# EAGLE board in3watch (EAGLE 6.4)
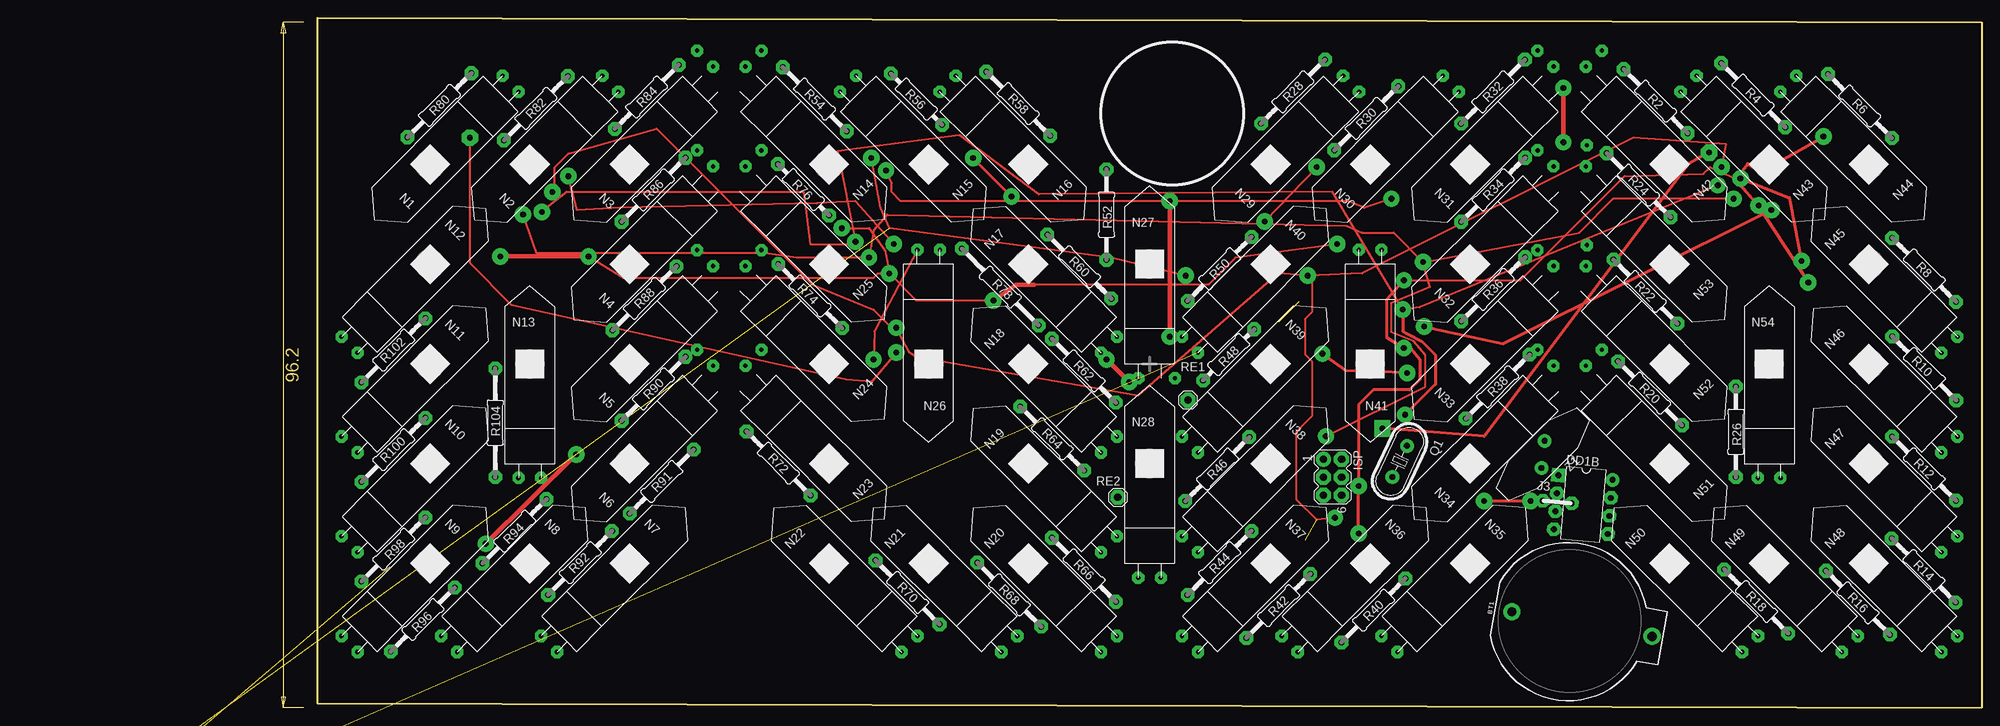
[diagram p5: board, top side]
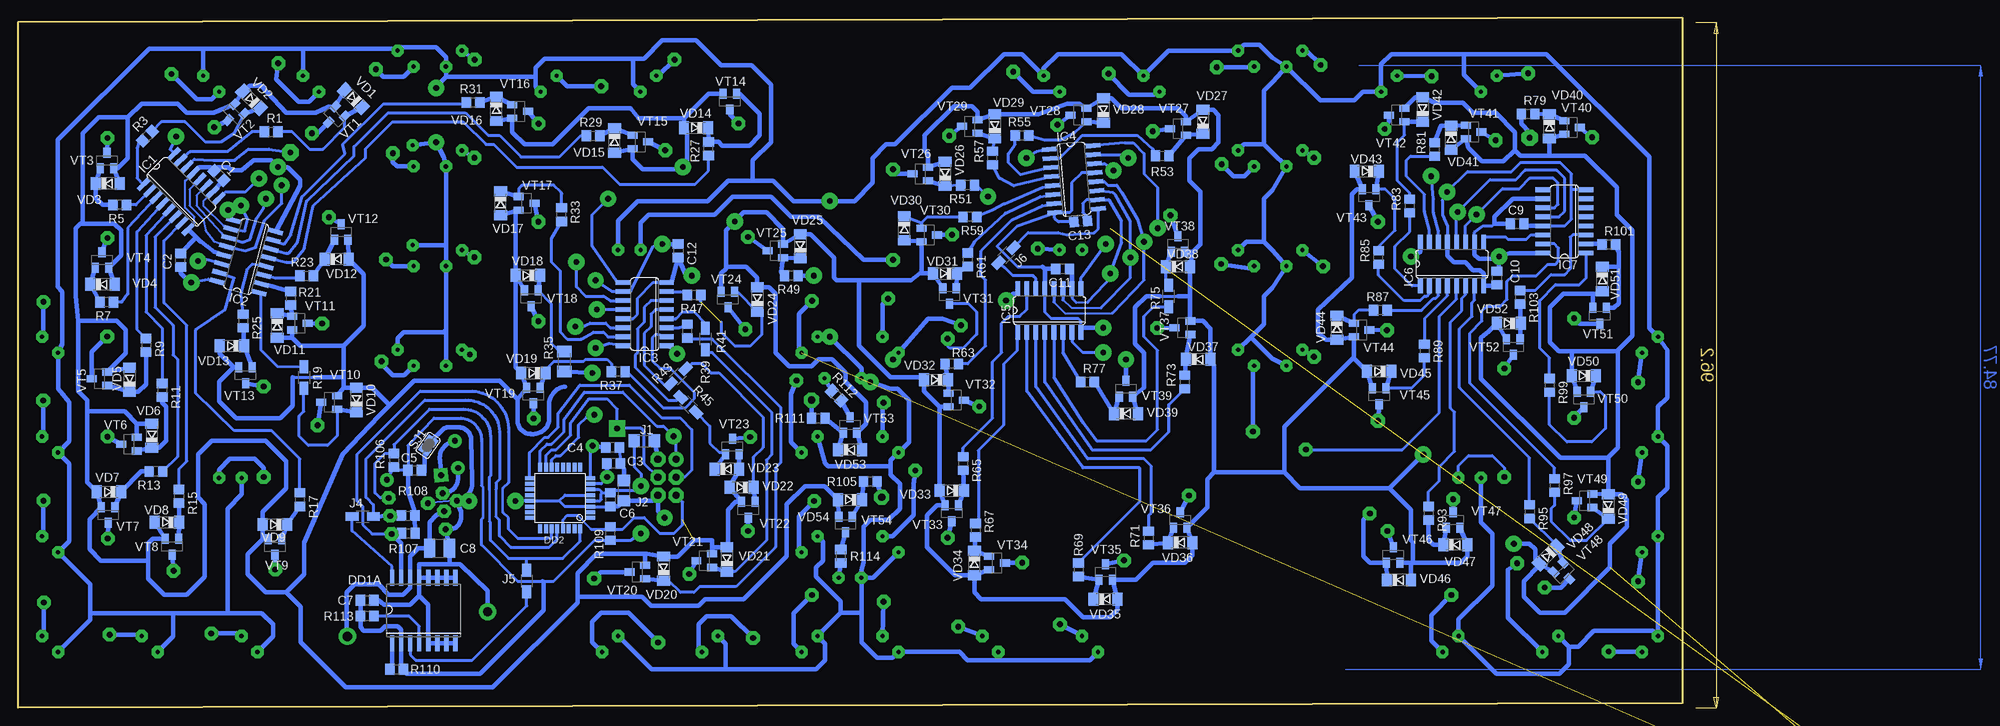
[diagram p6: board, bottom side, seen from below]

Size 233.68 x 96.84 mm. Coordinates in mm from the lower left corner, seen from the top.
Outline: 0,96.84 233.68,96.2 233.68,0 0,0.63 0,96.84
Copper layers (1*16): Top 0.035mm / dielectric 1.5mm / Bottom 0.035mm
Design rules "DesignRules": minimum track width 8mil, minimum drill 24mil, track to track 0.2mm, track to pad 0.2mm, pad to pad 8mil, via to via 8mil, smd to smd 8mil, copper to edge 10mil, drill to drill 8mil, minimum pad ring 0.55mm, minimum via ring 8mil, stop-mask expansion 4mil, vias tented up to drill 0mil, thermal gap 10mil

## Footprints (pad centres in the part's own frame; a part is rotated, then mirrored left to right if it is on the bottom)
BATTCOM_20MM_PTH = drill 1.3: 1 11.85,0; 2 -8.15,0
C0805 = smd 1.3 x 1.5: 1 -0.95,0; 2 0.95,0
C3225 = smd 1.6 x 2.7: 1 -1.4,0; 2 1.4,0
SOIC-16W = smd 0.6 x 2.2: 1 -4.445,-4.6; 2 -3.175,-4.6; 3 -1.905,-4.6; 4 -0.635,-4.6; 5 0.635,-4.6; 6 1.905,-4.6; 7 3.175,-4.6; 8 4.445,-4.6; 9 4.445,4.6; 10 3.175,4.6; 11 1.905,4.6; 12 0.635,4.6; 13 -0.635,4.6; 14 -1.905,4.6; 15 -3.175,4.6; 16 -4.445,4.6
DIL08 = drill 0.813 square: 1 -3.81,-3.81 | drill 0.813 octagon: 2 -1.27,-3.81; 3 1.27,-3.81; 4 3.81,-3.81; 5 3.81,3.81; 6 1.27,3.81; 7 -1.27,3.81 | drill 0.813: 8 -3.81,3.81
TQFP32-08 = smd 1.27 x 0.559: 1 -4.293,2.8; 2 -4.293,2; 3 -4.293,1.2; 4 -4.293,0.4; 5 -4.293,-0.4; 6 -4.293,-1.2; 7 -4.293,-2; 8 -4.293,-2.8; 17 4.293,-2.8; 18 4.293,-2; 19 4.293,-1.2; 20 4.293,-0.4; 21 4.293,0.4; 22 4.293,1.2; 23 4.293,2; 24 4.293,2.8 | smd 0.559 x 1.27: 9 -2.8,-4.293; 10 -2,-4.293; 11 -1.2,-4.293; 12 -0.4,-4.293; 13 0.4,-4.293; 14 1.2,-4.293; 15 2,-4.293; 16 2.8,-4.293; 25 2.8,4.293; 26 2,4.293; 27 1.2,4.293; 28 0.4,4.293; 29 -0.4,4.293; 30 -1.2,4.293; 31 -2,4.293; 32 -2.8,4.293
SO16 = smd 0.66 x 2.032: 1 -4.445,-3.073; 2 -3.175,-3.073; 3 -1.905,-3.073; 4 -0.635,-3.073; 5 0.635,-3.073; 6 1.905,-3.073; 7 3.175,-3.073; 8 4.445,-3.073; 9 4.445,3.073; 10 3.175,3.073; 11 1.905,3.073; 12 0.635,3.073; 13 -0.635,3.073; 14 -1.905,3.073; 15 -3.175,3.073; 16 -4.445,3.073
MA03-2 = drill 1.016: 1 -2.54,-1.27 | drill 1.016 octagon: 2 -2.54,1.27; 3 0,-1.27; 4 0,1.27; 5 2.54,-1.27; 6 2.54,1.27
R1206 = smd 1.6 x 1.803: 1 -1.422,0; 2 1.422,0
05 = drill 0.813 pad 1.6 octagon: 1 -0.04,0; 2 4.04,0
R1206W = smd 1.8 x 1.2: 1 -1.499,0; 2 1.499,0
IN-3 = drill 0.6 octagon: A -1.587,-16; K 1.587,-16
IN-3-2 = drill 0.6 octagon: A 1.413,-18; K 4.588,-18
IN-3-1 = drill 0.6 octagon: A -4.588,-18; K -1.413,-18
IN-3-3 = drill 0.6 octagon: A -1.587,-16; K 3.587,-16
IN-3-11 = drill 0.6 octagon: A -3.587,-20; K -1.413,-18
HC49U70 = drill 0.813: 1 -2.413,0; 2 2.413,0
R0805 = smd 1.3 x 1.5: 1 -0.95,0; 2 0.95,0
0207/12 = drill 0.813 octagon: 1 -6.35,0; 2 6.35,0
M1206 = smd 1.6 x 2: 1 -1.4,0; 2 1.4,0
0207/10 = drill 0.813 octagon: 1 -5.08,0; 2 5.08,0
0207/15 = drill 0.813 octagon: 1 -7.62,0; 2 7.62,0
M0805 = smd 1.3 x 1.6: 1 -0.95,0; 2 0.95,0
R0603 = smd 1 x 1.1: 1 -0.85,0; 2 0.85,0
1X01 = drill 1.016 octagon: 1 0,0
SJ = smd 1.168 x 1.6: 1 -0.762,0; 2 0.762,0
SOD80C = smd 1.4 x 1.8: A 1.7,0; C -1.7,0
SOT23-BEC = smd 1 x 1.4: B -0.95,-1.1; C 0,1.1; E 0.95,-1.1
FC-12M = drill 0.8: P$1 1.5,1.2; P$2 -1.5,-1.2

## Placement (x,y rotation side)
BT1  2032 3v  [BATTCOM_20MM_PTH]  175.74,12.06 350 top
C1  [C0805]  205.42,74.71 135 bottom
C2  [C0805]  210.82,62.8 90 bottom
C3  [C0805]  150.02,34.29 180 bottom
C4  [C0805]  150.18,36.51 180 bottom
C5  [C0805]  177.96,33.34 0 bottom
C6  [C0805]  150.5,29.21 270 bottom
C7  [C0805]  184.63,15.08 0 bottom
C8  [C3225]  174.47,22.38 0 bottom
C9  [C0805]  23.18,67.94 0 bottom
C10  [C0805]  26.03,60.32 270 bottom
C11  [C0805]  87,61.59 180 bottom
C12  [C0805]  140.97,64.13 270 bottom
C13  [C0805]  84.46,68.26 185 bottom
DD1A  [SOIC-16W]  176.69,13.65 0 bottom
DD1B  DS1307  [DIL08]  177.72,28.52 265 top
DD2  ATMEGA328P  [TQFP32-08]  157.53,29.44 180 bottom
IC1  74HC595D  [SO16]  210.73,72.46 315 bottom
IC2  74HC595D  [SO16]  201.6,63.34 75 bottom
IC3  74HC595D  [SO16]  145.67,55.24 90 bottom
IC4  74HC595D  [SO16]  85.43,74.2 275 bottom
IC5  74HC595D  [SO16]  88.85,55.77 0 bottom
IC6  74HC595D  [SO16]  32.33,62.29 0 bottom
IC7  74HC595D  [SO16]  16.54,68.27 90 bottom
ISP  [MA03-2]  142.55,32.35 270 top
J1  [R1206]  145.73,37.46 180 bottom
J2  [R1206]  148.59,30.48 90 bottom
J3  J5MM  [05]  172.09,29.05 355 top
J4  [R1206W]  185.26,26.83 0 bottom
J5  [R1206W]  162.24,17.78 270 bottom
J6  [R1206W]  94.93,63.5 225 bottom
N1  IN-3  [IN-3]  15.84,76.26 135 top
N2  IN-3  [IN-3]  29.84,76.26 135 top
N3  IN-32  [IN-3-2]  43.84,76.26 135 top
N4  IN-32  [IN-3-2]  43.84,62.26 135 top
N5  IN-32  [IN-3-2]  43.84,48.26 135 top
N6  IN-32  [IN-3-2]  43.84,34.26 135 top
N7  IN-3  [IN-3]  43.84,20.26 315 top
N8  IN-3  [IN-3]  29.84,20.26 315 top
N9  IN-3  [IN-3]  15.84,20.26 315 top
N10  IN-3  [IN-3]  15.84,34.26 315 top
N11  IN-3  [IN-3]  15.84,48.26 315 top
N12  IN-3  [IN-3]  15.84,62.26 315 top
N13  IN-3  [IN-3]  29.84,48.26 0 top
N14  IN-31  [IN-3-1]  71.84,76.26 225 top
N15  IN-3  [IN-3]  85.84,76.26 225 top
N16  IN-3  [IN-3]  99.84,76.26 225 top
N17  IN-3  [IN-3]  99.84,62.26 45 top
N18  IN-3  [IN-3]  99.84,48.26 45 top
N19  IN-3  [IN-3]  99.84,34.26 45 top
N20  IN-3  [IN-3]  99.84,20.26 45 top
N21  IN-3  [IN-3]  85.84,20.26 45 top
N22  IN-3  [IN-3]  71.84,20.26 45 top
N23  IN-31  [IN-3-1]  71.84,34.26 225 top
N24  IN-31  [IN-3-1]  71.84,48.26 225 top
N25  IN-31  [IN-3-1]  71.84,62.26 225 top
N26  IN-3  [IN-3]  85.84,48.26 180 top
N27  IN-33  [IN-3-3]  116.84,62.26 0 top
N28  IN-3  [IN-3]  116.84,34.26 0 top
N29  IN-3  [IN-3]  133.84,76.26 135 top
N30  IN-3  [IN-3]  147.84,76.26 135 top
N31  IN-32  [IN-3-2]  161.84,76.26 135 top
N32  IN-32  [IN-3-2]  161.84,62.26 135 top
N33  IN-32  [IN-3-2]  161.84,48.26 135 top
N34  IN-32  [IN-3-2]  161.84,34.26 135 top
N35  IN-3  [IN-3]  161.84,20.26 315 top
N36  IN-3  [IN-3]  147.84,20.26 315 top
N37  IN-3  [IN-3]  133.84,20.26 315 top
N38  IN-3  [IN-3]  133.84,34.26 315 top
N39  IN-3  [IN-3]  133.84,48.26 315 top
N40  IN-3  [IN-3]  133.84,62.26 315 top
N41  IN-3  [IN-3]  147.84,48.26 180 top
N42  IN-31  [IN-3-1]  189.84,76.26 225 top
N43  IN-3  [IN-3]  203.84,76.26 225 top
N44  IN-3  [IN-3]  217.84,76.26 225 top
N45  IN-3  [IN-3]  217.84,62.26 45 top
N46  IN-3  [IN-3]  217.84,48.26 45 top
N47  IN-3  [IN-3]  217.84,34.26 45 top
N48  IN-3  [IN-3]  217.84,20.26 45 top
N49  IN-3  [IN-3]  203.84,20.26 45 top
N50  IN-3  [IN-3]  189.84,20.26 45 top
N51  IN-31  [IN-3-1]  189.84,34.26 225 top
N52  IN-311  [IN-3-11]  189.84,48.26 225 top
N53  IN-311  [IN-3-11]  189.84,62.26 225 top
N54  IN-3  [IN-3]  203.84,48.26 0 top
Q1  [HC49U70]  151.97,34.57 245 top
R1  [R0805]  198.12,80.84 0 bottom
R2  [0207/12]  187.9,85.12 135 top
R3  [R0805]  215.5,80.26 45 bottom
R4  [0207/12]  201.6,85.97 135 top
R5  [R0805]  219.36,70.57 180 bottom
R6  [0207/12]  216.59,84.45 135 top
R7  [R0805]  221.19,56.91 180 bottom
R8  [0207/12]  225.59,61.45 315 top
R9  [R0805]  215.68,50.86 270 bottom
R10  [0207/12]  225.62,47.62 315 top
R11  [R0805]  213.41,44.58 270 bottom
R12  [0207/12]  225.59,33.56 315 top
R13  [R0805]  214.28,33.16 180 bottom
R14  [0207/12]  225.53,19.27 315 top
R15  [R0805]  211.06,29.69 270 bottom
R16  [0207/12]  216.3,14.74 315 top
R17  [R0805]  194.09,29.21 270 bottom
R18  [0207/12]  202.03,14.92 315 top
R19  [R1206W]  193.52,46.35 270 bottom
R20  [0207/12]  187.1,44.13 135 top
R21  [R0805]  195.36,57.47 270 bottom
R22  [0207/12]  186.47,58.42 135 top
R23  [R0805]  193.13,60.64 0 bottom
R24  [0207/12]  185.51,73.34 135 top
R25  [R0805]  202.03,54.29 270 bottom
R26  [0207/12]  199.17,38.73 270 top
R27  [R0805]  136.71,78.47 90 bottom
R28  [0207/12]  137,86.48 45 top
R29  [R0805]  152.92,80.28 0 bottom
R30  [0207/12]  147.28,82.74 45 top
R31  [R0805]  169.75,84.96 0 bottom
R32  [0207/12]  165.06,86.47 45 top
R33  [R0805]  157.32,69.22 90 bottom
R34  [0207/12]  165.1,72.71 45 top
R35  [M1206]  156.96,48.58 90 bottom
R36  [0207/12]  165.1,58.74 45 top
R37  [R0805]  149.38,47.15 180 bottom
R38  [0207/12]  165.74,45.09 45 top
R39  [R0805]  139.7,52.86 270 bottom
R40  [0207/12]  148.27,13.65 225 top
R41  [R1206W]  137.16,51.75 270 bottom
R42  [0207/12]  134.94,14.29 225 top
R43  [R1206W]  140.97,46.51 45 bottom
R44  [0207/12]  126.68,20.32 225 top
R45  [R1206W]  139.54,42.55 315 bottom
R46  [0207/12]  126.37,33.5 225 top
R47  [R0805]  138.75,57.94 0 bottom
R48  [0207/10]  127.95,49.53 225 top
R49  [R0805]  125.09,60.64 180 bottom
R50  [0207/12]  126.68,61.59 225 top
R51  [R0805]  100.33,73.34 180 bottom
R52  [0207/12]  110.81,69.22 270 top
R53  [R0805]  73.03,77.47 0 bottom
R54  [0207/12]  69.85,85.41 135 top
R55  [R0805]  92.71,80.33 0 bottom
R56  [0207/10]  84.14,85.41 135 top
R57  [R0805]  96.84,77.15 90 bottom
R58  [0207/12]  98.43,84.77 135 top
R59  [R0805]  100.01,68.9 180 bottom
R60  [0207/12]  107,61.91 315 top
R61  [R0805]  100.33,62.86 270 bottom
R62  [0207/12]  107.63,47.31 315 top
R63  [R0805]  102.55,48.26 180 bottom
R64  [0207/12]  103.19,37.78 315 top
R65  [R0805]  100.97,34.29 270 bottom
R66  [0207/12]  107.63,19.37 315 top
R67  [R0805]  99.22,24.92 270 bottom
R68  [0207/12]  97.16,15.88 315 top
R69  [R0805]  84.77,19.37 270 bottom
R70  [0207/12]  82.87,16.19 315 top
R71  [R0805]  74.93,23.81 270 bottom
R72  [0207/12]  64.77,34.29 135 top
R73  [R0805]  69.85,45.72 90 bottom
R74  [0207/12]  69.22,57.78 135 top
R75  [R1206W]  72.07,57.78 90 bottom
R76  [0207/10]  68.26,72.71 135 top
R77  [R0805]  83.5,45.72 0 bottom
R78  [0207/15]  95.89,59.05 315 top
R79  [R0805]  21.65,83.34 0 bottom
R80  [0207/12]  17.16,84.57 45 top
R81  [R0805]  34.77,78.36 90 bottom
R82  [0207/12]  30.7,84.14 45 top
R83  [R0805]  38.26,70.42 90 bottom
R84  [0207/12]  46.26,85.72 45 top
R85  [R0805]  42.64,63.18 90 bottom
R86  [0207/12]  47.21,72.71 45 top
R87  [R0805]  42.39,55.78 180 bottom
R88  [0207/12]  45.94,57.47 45 top
R89  [R0805]  36.2,50.07 270 bottom
R90  [0207/12]  47.21,44.77 45 top
R91  [0207/12]  48.36,31.75 225 top
R92  [0207/12]  36.89,20.32 225 top
R93  [R0805]  35.62,27.3 270 bottom
R94  [0207/12]  27.69,24.76 225 top
R95  [R0805]  21.43,27.53 270 bottom
R96  [0207/12]  14.83,12.38 225 top
R97  [R0805]  17.94,31.18 270 bottom
R98  [0207/12]  10.7,22.22 225 top
R99  [R0805]  18.64,45.24 270 bottom
R100  [0207/12]  10.7,36.2 225 top
R101  [R0805]  10.32,65.02 0 bottom
R102  [0207/12]  10.7,50.16 225 top
R103  [R0805]  22.77,57.63 270 bottom
R104  [0207/15]  24.99,40 270 top
R105  [R0805]  113.98,31.75 180 bottom
R106  10k  [R0805]  180.86,34.74 270 bottom
R107  10k  [R0805]  178.84,24.5 0 bottom
R108  10k  [R0805]  178.89,26.96 0 bottom
R109  10k  [R0805]  150.5,24.45 270 bottom
R110  10k  [R0805]  180.5,5.4 0 bottom
R111  [R0805]  121.28,40.64 0 bottom
R112  [M0805]  118.75,43.81 135 bottom
R113  10k  [R0805]  184.63,12.86 180 bottom
R114  [M0805]  118.11,21.27 270 bottom
R115  [R0603]  -44.77,-23.81 270 top  (outside the outline)
R116  [R0603]  -40,-22.54 90 top  (outside the outline)
RE1  [1X01]  122.24,43.18 270 top
RE2  [1X01]  112.4,29.53 90 top
SJ1  [SJ]  176.05,36.83 55 bottom
VD1  [SOD80C]  186.57,85.5 135 bottom
VD2  [SOD80C]  200.87,85.33 135 bottom
VD3  [SOD80C]  221.05,73.58 0 bottom
VD4  [SOD80C]  221.79,59.42 0 bottom
VD5  [SOD80C]  218,46.02 90 bottom
VD6  [SOD80C]  214.87,38.18 90 bottom
VD7  [SOD80C]  220.88,30.3 180 bottom
VD8  [SOD80C]  212.74,26.05 180 bottom
VD9  [SOD80C]  197.58,25.72 180 bottom
VD10  [SOD80C]  186.15,43.18 90 bottom
VD11  [SOD80C]  197.26,53.66 270 bottom
VD12  [SOD80C]  188.91,62.96 0 bottom
VD13  [SOD80C]  203.61,50.8 180 bottom
VD14  [SOD80C]  138.47,81.42 180 bottom
VD15  [SOD80C]  149.91,79.61 270 bottom
VD16  [SOD80C]  166.5,84.05 270 bottom
VD17  [SOD80C]  165.89,70.8 270 bottom
VD18  [SOD80C]  162.08,60.69 180 bottom
VD19  [SOD80C]  161.29,46.99 180 bottom
VD20  [SOD80C]  143.03,19.53 90 bottom
VD21  [SOD80C]  134.14,20.8 90 bottom
VD22  [SOD80C]  132.08,30.96 180 bottom
VD23  [SOD80C]  134.14,33.5 0 bottom
VD24  [SOD80C]  129.86,57.31 90 bottom
VD25  [SOD80C]  123.83,64.77 90 bottom
VD26  [SOD80C]  103.5,74.93 90 bottom
VD27  [SOD80C]  67.31,82.23 90 bottom
VD28  [SOD80C]  81.28,83.82 90 bottom
VD29  [SOD80C]  96.52,81.6 90 bottom
VD30  [SOD80C]  109.22,67.31 270 bottom
VD31  [SOD80C]  103.5,60.96 180 bottom
VD32  [SOD80C]  104.78,46.04 180 bottom
VD33  [SOD80C]  102.55,30.48 180 bottom
VD34  [SOD80C]  99.38,20.32 270 bottom
VD35  [SOD80C]  80.96,15.24 0 bottom
VD36  [SOD80C]  70.49,23.18 0 bottom
VD37  [SOD80C]  67.94,48.89 0 bottom
VD38  [SOD80C]  70.8,61.91 0 bottom
VD39  [SOD80C]  78.11,41.27 0 bottom
VD40  [SOD80C]  18.64,81.6 270 bottom
VD41  [SOD80C]  32.45,80.01 270 bottom
VD42  [SOD80C]  36.45,83.98 90 bottom
VD43  [SOD80C]  44.29,75.31 180 bottom
VD44  [SOD80C]  48.48,53.34 270 bottom
VD45  [SOD80C]  42.55,47.21 180 bottom
VD46  [SOD80C]  39.78,17.94 0 bottom
VD47  [SOD80C]  31.84,22.86 0 bottom
VD48  [SOD80C]  18.83,21.43 225 bottom
VD49  [SOD80C]  10.38,28.26 90 bottom
VD50  [SOD80C]  13.81,46.61 180 bottom
VD51  [SOD80C]  11.21,60.17 270 bottom
VD52  [SOD80C]  24.35,53.97 180 bottom
VD53  [SOD80C]  116.84,36.2 0 bottom
VD54  [SOD80C]  116.84,29.21 180 bottom
VD55  [SOD80C]  -42.23,-26.35 0 top  (outside the outline)
VT1  [SOT23-BEC]  189.25,82.94 135 bottom
VT2  [SOT23-BEC]  203.37,83.27 135 bottom
VT3  [SOT23-BEC]  221.16,76.83 0 bottom
VT4  [SOT23-BEC]  221.87,62.86 0 bottom
VT5  [SOT23-BEC]  222.2,46.18 90 bottom
VT6  [SOT23-BEC]  218.09,36.99 90 bottom
VT7  [SOT23-BEC]  221,27.05 180 bottom
VT8  [SOT23-BEC]  212.03,22.6 180 bottom
VT9  [SOT23-BEC]  197.58,22.54 180 bottom
VT10  [SOT23-BEC]  189.96,42.86 90 bottom
VT11  [SOT23-BEC]  194.09,53.97 270 bottom
VT12  [SOT23-BEC]  188.28,66.77 0 bottom
VT13  [SOT23-BEC]  201.71,46.67 180 bottom
VT14  [SOT23-BEC]  133.71,85.07 180 bottom
VT15  [SOT23-BEC]  146.26,79.42 270 bottom
VT16  [SOT23-BEC]  163.17,83.7 270 bottom
VT17  [SOT23-BEC]  162.24,70.8 270 bottom
VT18  [SOT23-BEC]  161.61,57.47 180 bottom
VT19  [SOT23-BEC]  161.29,43.81 180 bottom
VT20  [SOT23-BEC]  146.69,19.05 90 bottom
VT21  [SOT23-BEC]  137.32,20.64 90 bottom
VT22  [SOT23-BEC]  131.13,27.78 180 bottom
VT23  [SOT23-BEC]  133.35,36.67 0 bottom
VT24  [SOT23-BEC]  133.99,57.31 180 bottom
VT25  [SOT23-BEC]  127.32,64.13 90 bottom
VT26  [SOT23-BEC]  107,74.93 90 bottom
VT27  [SOT23-BEC]  70.8,81.28 90 bottom
VT28  [SOT23-BEC]  84.77,83.19 90 bottom
VT29  [SOT23-BEC]  100.01,81.6 90 bottom
VT30  [SOT23-BEC]  105.73,66.36 270 bottom
VT31  [SOT23-BEC]  102.87,57.78 180 bottom
VT32  [SOT23-BEC]  101.92,43.18 270 bottom
VT33  [SOT23-BEC]  102.55,27.3 180 bottom
VT34  [SOT23-BEC]  96.2,20.32 270 bottom
VT35  [SOT23-BEC]  80.96,19.05 0 bottom
VT36  [SOT23-BEC]  70.49,26.35 0 bottom
VT37  [SOT23-BEC]  70.17,53.34 90 bottom
VT38  [SOT23-BEC]  70.8,65.09 0 bottom
VT39  [SOT23-BEC]  78.11,44.77 0 bottom
VT40  [SOT23-BEC]  15.46,81.44 270 bottom
VT41  [SOT23-BEC]  29.27,80.8 270 bottom
VT42  [SOT23-BEC]  40.1,83.19 90 bottom
VT43  [SOT23-BEC]  43.97,71.66 180 bottom
VT44  [SOT23-BEC]  44.99,53.02 270 bottom
VT45  [SOT23-BEC]  42.55,43.72 180 bottom
VT46  [SOT23-BEC]  40.58,21.43 0 bottom
VT47  [SOT23-BEC]  32.16,26.35 0 bottom
VT48  [SOT23-BEC]  16.61,18.89 225 bottom
VT49  [SOT23-BEC]  13.72,29.05 90 bottom
VT50  [SOT23-BEC]  13.81,43.27 180 bottom
VT51  [SOT23-BEC]  11.59,55.02 180 bottom
VT52  [SOT23-BEC]  23.72,50.64 180 bottom
VT53  [SOT23-BEC]  116.84,39.69 0 bottom
VT54  [SOT23-BEC]  117.48,25.72 180 bottom
VT55  [SOT23-BEC]  -42.23,-23.18 0 top  (outside the outline)
Z1  32768  [FC-12M]  172.09,35.56 225 top

## Tracks (layer width: path | path; a pad name or v marks a point on that pad's centre or on a via)
+5V  (via drill 0.8 pad 2.3)
  Top 0.254: v38.1,63.34 43.02,60.32 78.11,60.32 78.74,60.96 v80.33,60.96 | v152.56,60.01 168.91,60.01 183.51,74.61 194.63,74.93 195.58,75.88 199.01,74.3 v202.34,70.48 | v73.66,67.31 77.47,67.31 79.69,64.13 v80.33,60.96 | v143.19,65.09 128.91,63.18 125.09,59.37 100.65,59.37 | v94.93,57.15 84.14,57.15 v80.33,60.96
  Top 0.406: v209.33,59.69 v202.34,70.48 199.07,74.14 200.82,76.36 202.72,75.25 v211.45,80.17 | v146.21,24.45 v146.21,31.11 146.21,42.55 148.27,44.61 153.35,44.61 154.78,46.04 154.78,48.89 153.51,50.48 v152.56,50.48 150.18,51.91 150.18,57.31 v152.56,60.01
  Top 0.61: v25.72,63.34 v38.1,63.34 | 100.65,59.37 98.11,59.37 v94.93,57.15
  Bottom 0.305: 85.09,56.91 83.5,56.91 | IC1.10 207.65,71.06 207.65,70.48 204.79,67.63 IC2.10
  Bottom 0.33: 168.38,26.67 168.38,30.96
  Bottom 0.406: IC1.16 212.3,78.37 v211.45,80.17 | IC2.10 201.81,66.89 201.39,68.58 v202.34,70.48 | v209.33,59.69 206.95,60.17 IC2.16 | DD2.6 152.09,30.64 151.61,30.16 | DD2.4 151.93,29.04 151.76,29.21 151.76,30 151.61,30.16 | DD1B.8 R106.2 180.86,33.34 C5.1 178.91,36.83 175.26,40.64 171.45,40.64 arc90 168.59,37.46 168.59,31.17 168.38,30.96 | R109.2 152.72,23.49 158.43,17.78 160.02,17.78 163.51,17.78 168.59,22.86 168.59,26.45 168.38,26.67 | R109.2 147.64,23.49 v146.21,24.45 | v152.56,60.01 150.18,58.42 IC3.10 147.64,58.42 144.47,64.77 C12.1 | IC3.16 150.65,51.12 v152.56,50.48 | J1.2 147.15,33.81 146.21,32.86 v146.21,31.11 146.84,30.48 149.86,30.48 150.18,30.16 C6.1 151.61,30.16 | IC5.10 85.68,57.5 85.09,56.91 | IC6.10 29.15,66.73 27.94,67.63 26.67,67.63 26.35,67.94 | 83.5,56.91 80.01,60.64 v80.33,60.96 78.74,65.41 78.74,68.26 80.51,71.3 IC4.10 83.64,71.3 84.14,70.8 84.14,69.53 83.51,68.9 C13.1 | v73.66,67.31 73.66,73.03 75.56,74.93 75.56,77.79 77.06,79.28 78.24,79.28 IC4.16 | R109.2
  Bottom 0.61: R107.2 R108.2 177.94,27.6 178.91,30.32 C5.1 | 160.02,17.78 159.86,17.62 159.86,13.65 168.75,4.76 179.07,4.76 R110.2 179.86,5.71 DD1A.2 179.86,10.95 180.34,11.43 182.09,11.43 182.72,10.79 185.1,10.79 185.58,11.27 R113.2 C7.1 | IC7.16 24.3,63.83 v25.72,63.34 | IC6.10 29.15,63.6 28.58,63.02 26.35,63.02 v25.72,63.34 | v38.1,63.34 36.77,64.03 IC6.16 | IC7.10 22.53,71.45 22.54,71.44 23.81,71.44 26.35,68.9 26.35,67.94 C9.1 | C10.1 25.72,61.59 v25.72,63.34 | IC5.10 85.68,60.91 C11.1 | C12.1 v143.19,65.09 | C2.1 210.82,60.96 209.55,59.69 v209.33,59.69 | IC5.16 93.3,58.15 93.34,58.1 93.98,58.1 v94.93,57.15 | IC1.10 C1.1
+5VISP
  Bottom 0.61: ISP.2 J1.1
+100V  (via drill 0.8 pad 2.3)
  Top 0.61: v174.94,79.38 v174.94,87 | v119.7,71.12 v119.7,52.07 | v110.81,48.89 v113.98,45.72
  Bottom 0.61: 173.57,64.94 N32.A 173.89,77.37 v174.94,79.38 N53.A | 173.57,64.94 N33.A 173.57,53.02 | 173.57,53.02 N34.A | 223.52,13.26 211.84,13.26 | 211.84,13.26 204.25,13.26 | 204.25,13.26 199.41,13.26 197.84,11.69 197.84,10.02 N50.A | 193.65,92.53 180.36,92.53 N42.A 179.88,92.71 174.94,92.71 173.57,91.34 N31.A 173.57,88.58 | 193.65,92.53 207.65,92.53 | 207.65,92.53 215.22,92.53 228.06,79.69 228.06,59.05 227.43,58.42 227.43,51.06 N45.A 228.03,44.74 226.48,42.86 226.48,37.38 N46.A 226.47,34.27 226.47,23.38 N47.A 223.52,17.31 223.52,13.26 | N49.A 211.84,10.02 211.84,13.26 | N44.A 207.65,92.53 | N52.A 173.57,64.94 | N28.A 115.25,13.34 | N28.A 113.59,18.26 N19.A | N28.A 115.25,19.37 114.94,20.32 114.94,25.4 113.98,26.35 111.44,26.35 109.86,27.94 109.86,31.43 111.12,32.7 111.12,33.97 | N40.A v119.7,52.07 115.25,47.62 N27.A v113.98,45.72 111.12,44.77 110.17,44.77 108.59,43.18 108.59,37.27 N18.A | N23.A 60.58,52.01 | 60.58,52.01 58.74,53.85 58.74,57.78 57.57,58.95 N5.A 57.57,64.24 58.74,65.41 | 58.74,65.41 61.18,65.41 N24.A | 58.74,65.41 58.74,71.44 57.57,72.61 N4.A 57.57,77.89 58.74,79.06 | 58.74,79.06 61.53,79.06 N25.A | 58.74,79.06 58.74,86.6 57.57,87.76 N3.A | N3.A 57.57,91.22 59.37,93.03 61.56,93.03 N14.A 72.11,92.23 N15.A 78.71,91.76 87.63,91.76 89.65,89.74 N16.A 92.71,91.76 95.25,91.76 100.01,87 102.55,87 110.49,79.06 111.76,79.06 113.67,77.15 113.67,73.66 116.2,71.12 v119.7,71.12 124.78,71.12 127.64,73.98 130.49,73.98 | 160.97,88.58 173.57,88.58 | N51.A 180.36,51.83 179.48,52.7 173.89,52.7 173.57,53.02 | N54.A 202.25,29.93 204.25,27.94 204.25,13.26 | 147.32,91.12 145.73,91.12 143.19,93.66 138.43,93.66 134.94,90.17 130.65,90.17 127.95,87.47 127.95,79.38 130.49,76.83 130.49,73.98
  Bottom 0.61: 147.32,91.12 159.7,91.12 160.97,89.85 160.97,88.58 | N30.A 160.97,87.15 160.97,88.58 | 134.3,5.4 121.6,5.4 120.33,6.67 120.33,9 N37.A 118.14,13.34 | 115.25,13.34 118.14,13.34 | N36.A 134.3,8.97 134.3,5.4 | 115.25,13.34 115.25,9.21 113.03,6.98 110.87,6.98 N20.A 101.49,7.82 100.33,6.67 96.03,6.67 | N22.A 83.19,6.67 96.03,6.67 | N21.A 96.03,6.67 | N6.A 57.57,49 60.58,52.01 | N3.A 50.83,85.25 46.04,85.25 44.84,86.45 N2.A 42.28,90.34 40.86,91.76 30.64,91.76 | 134.3,5.4 144.73,5.4 N35.A | 30.64,91.76 19.05,91.76 4.6,77.31 4.6,53.27 N12.A 2.13,50.16 2.13,43.5 3.4,42.22 N11.A 2.13,36.79 2.13,30.8 3.4,29.52 N10.A N9.A 4.13,10.79 12.38,10.79 14.62,8.56 15.89,8.56 | N1.A 30.64,88.81 30.64,91.76 | v110.81,48.89 110.64,49.21 N17.A 105.88,54.61 103.82,54.61 R78.2 | N43.A 193.65,92.53 | v174.94,87 174.94,87.21 173.57,88.58 | N29.A 147.32,87.5 147.32,91.12 | N48.A 223.52,12.34 223.52,13.26 | N41.A 149.43,68.38 146.69,71.12 136.84,71.12 133.99,73.98 130.49,73.98 | N13.A 28.25,26.03 26.67,24.45 26.67,17.14 31.4,12.41 N7.A 26.1,4.76 17.26,4.76 15.89,6.13 15.89,8.56 | 15.89,8.56 N8.A | 118.14,13.34 118.14,14.95 121.6,18.41 121.6,19.68 120.65,20.64 120.65,23.31 N38.A | 110.08,35.82 N18.A | 111.12,33.97 111.12,34.73 N18.A | 111.12,33.97 111.18,33.92 119.96,33.92 120.33,34.29 N39.A
A1
  Bottom 0.61: N42.K 179.51,88.58 182.38,88.58 R2.2
A2
  Bottom 0.61: N43.K 192.76,85.09 194.28,85.09 197.43,88.24 R4.2
A3
  Bottom 0.61: R6.2 208.56,85.41 206.45,85.41 N44.K
A4
  Bottom 0.61: N45.K 230.09,52.26 R8.2
A5
  Bottom 0.61: N46.K 230.11,38.24 R10.2
A6
  Bottom 0.61: N47.K 230.07,24.27 R12.2
A7
  Bottom 0.61: R14.2 230.03,10.32 N48.K
A8
  Bottom 0.61: R16.2 216.46,10.25 N49.K
A9
  Bottom 0.61: R18.2 202.64,10.43 N50.K
A10
  Bottom 0.61: R20.2 182.61,48.21 181.07,46.67 179.43,46.67 N51.K
A11
  Bottom 0.61: N52.K 181.05,61.99 R22.2
A12
  Bottom 0.61: N53.K 180.44,75.99 181.03,76.57 R24.2
A13
  Bottom 0.61: N54.K 205.43,33.43 203.93,34.92 200.44,34.92 199.17,33.66 R26.2
B1
  Bottom 0.61: R28.2 143.76,88.7 N29.K
B2
  Bottom 0.61: R30.2 156.56,87.23 N30.K
B3
  Bottom 0.61: R32.2 N31.K
B4
  Bottom 0.61: R34.2 N32.K
B5
  Bottom 0.61: R36.2 N33.K
B6
  Bottom 0.61: R38.2 N34.K
B7
  Bottom 0.61: N35.K 153.03,9.21 153.03,12.06 151.76,13.34 147.96,13.34 R40.2
B8
  Bottom 0.61: N36.K 138.11,8.29 138.11,11.75 137,12.86 133.51,12.86 R42.2
B9
  Bottom 0.61: 123.9,7.57 N37.K | 123.78,7.95 N37.K | R44.2 124.78,13.24 124.78,8.95 N37.K
B10
  Bottom 0.61: R46.2 123.98,26.9 123.98,22.16 N38.K
B11
  Bottom 0.61: N39.K 125.09,37.27 125.09,44.04 R48.2
B12  (1 unrouted)
  Bottom 0.61: N40.K 123.98,50.16 123.98,55.31 R50.2
B13
  Bottom 0.61: N41.K 146.25,68.06 145.1,69.22 135.89,69.22 133.35,71.75 127.95,71.75 125.09,68.9 121.28,68.9 114.94,62.86 R52.2
C1
  Bottom 0.61: R54.2 60.2,89.9 N14.K
C2
  Bottom 0.61: R56.2 77.7,86.04 74.13,86.04 N15.K
C3
  Bottom 0.61: N16.K 91.12,86.45 R58.2
C4
  Bottom 0.61: N17.K 112.28,56.63 R60.2
C5
  Bottom 0.61: N18.K 112.28,42.66 R62.2
C6
  Bottom 0.61: N19.K 110.87,24.07 107.95,26.99 107.95,31.34 R64.2
C7
  Bottom 0.61: N20.K R66.2
C8
  Bottom 0.61: N21.K R68.2
C9
  Bottom 0.61: N22.K R70.2
C10
  Bottom 0.61: R72.2 60.28,47.99 N23.K
C11
  Bottom 0.61: R74.2 60.46,61.64 N24.K
C12
  Bottom 0.61: N25.K 61.49,74.61 62.98,74.61 R76.2
C13  (via drill 0.8 pad 2.3)
  Top 0.254: N26.K 78.22,52.82 v78.11,48.89
  Bottom 0.61: v78.11,48.89 VT39.C
D1
  Bottom 0.61: R80.2 N1.K
D2
  Bottom 0.61: R82.2 N2.K
D3
  Bottom 0.61: N3.K 52.77,92.23 R84.2
D4
  Bottom 0.61: R86.2 N4.K
D5
  Bottom 0.61: R88.2 N5.K
D6
  Bottom 0.61: R90.2 N6.K
D7
  Bottom 0.61: N7.K 35.24,9.42 35.24,12.99 R92.2
D8
  Bottom 0.61: R94.2 24.45,19.34 24.45,12.62 N8.K
D9
  Bottom 0.61: N9.K 5.72,7.89 R96.2
D10
  Bottom 0.61: N10.K R98.2
D11
  Bottom 0.61: N11.K R100.2
D12
  Bottom 0.61: N12.K R102.2
D13
  Bottom 0.406: N13.K 31.43,33.98 30,35.4 26.67,35.4 24.99,33.72 R104.2
E1
  Bottom 0.61: R112.2 N27.K
E2
  Bottom 0.61: N28.K R114.2
GND  (via drill 0.8 pad 2.3)  (4 unrouted)
  Top 0.254: v133.03,68.26 v140.34,75.88 | v139.06,60.64 134.94,60.96 115.25,43.81 84.14,49.21 83.19,49.85 v81.28,53.34 80.65,53.34 78.11,55.88 69.53,59.37 47.62,81.28 35.24,77.79 33.34,75.88 33.34,72.71 v33.02,72.39 | v197.17,75.88 197.8,79.06 184.78,80.01 146.69,60.96 v139.06,60.64 | v142.88,26.67 140.34,26.35 137.48,29.21 137.48,38.73 139.7,40.96 139.7,48.58 138.75,49.53 138.75,54.61 139.7,55.56 139.7,60.64 v139.06,60.64
  Top 0.406: v163.83,29.03 v170.34,29.03
  Top 0.61: v23.65,23.02 v36.35,35.56
  Bottom 0.254: 172.4,29.05 175.59,28.75 175.74,28.73
  Bottom 0.305: IC1.8 208.92,68 208.92,68.9 210.19,70.17 210.19,73.98 210.12,73.98 IC1.13
  Bottom 0.406: 157.65,29.04 DD2.21 163.34,29.04 v163.83,29.03 | 157.65,29.04 156.84,29.84 DD2.5 | 157.65,29.04 156.85,28.24 DD2.3 150.51,28.24 C6.2 | J3.2 175.59,28.75 | J3.1 171.13,29.21 | 172.4,29.05 J3.1 | v170.34,29.03 J3.1 | 195.1,46.35 192.09,46.35 | 207.96,65.41 208.02,65.41 | IC3.13 147.32,54.61 146.69,55.24 146.69,57.47 144.46,59.69 IC3.8 | IC7.13 16.5,67.64 15.56,68.58 15.56,72.72 | IC7.8 15.56,72.72 | 15.56,72.72 15.56,74.93 17.15,76.52 22.7,76.52 23.97,75.25 30.16,75.25 v33.02,72.39 33.66,71.12 33.66,69.22 32.96,67.57 IC6.13 | 73.34,57.78 70.8,57.78 | IC5.13 89.49,55.51 88.58,54.61 84.77,54.61 84.41,54.24 IC5.8 | 89.85,61.91 93.34,61.91 96.2,64.77 93.34,67.63 IC4.8 | 21.92,67.64 C9.2 | IC4.13 84.29,75.1 85.73,73.66 85.73,69.77 86,69.5 IC4.8 | C13.2 87.55,68.18 88.1,68.74 IC4.8
  Bottom 0.61: VD1.A VT1.E 190.03,84.38 191.87,83.5 195.99,83.5 199.49,87.31 201.13,87.31 VD2.A VT2.E 206.15,83.5 209.96,83.5 211.23,84.77 216.31,84.77 218.22,82.87 | 208.02,65.41 208.63,66.01 | 208.63,66.01 IC1.8 | VD5.A VT5.E 218.53,49.73 218.53,53.02 219.81,54.29 225.2,54.29 | VD4.A VT4.E 219.17,63.51 219.17,66.99 220.12,67.94 224.57,67.94 | 218.22,82.87 218.22,77.15 219.64,75.73 VT3.E VD3.A | 224.57,67.94 224.57,80.64 222.34,82.87 218.22,82.87 | 224.57,67.94 224.88,67.94 225.52,67.31 225.52,57.78 225.2,54.29 | 223.93,41.59 218.7,41.59 216.99,39.88 | 225.2,54.29 225.2,44.45 223.93,43.18 223.93,41.59 | 223.93,41.59 223.93,31.65 VD7.A VT7.E 223.62,26.48 223.62,22.22 222.03,20.64 215.36,20.64 | VD8.A VT8.E 214.73,23.7 215.36,23.07 215.36,20.64 | IC2.8 194.01,73.27 194.01,74.1 195.79,75.88 v197.17,75.88 198.12,76.83 200.6,76.83 202.25,75.41 203.68,75.41 204.15,75.88 205.59,75.88 C1.2 206.6,75.88 208.21,75.88 IC1.13 | 215.36,20.64 215.36,18.1 213.14,15.88 209.96,15.88 207.42,18.41 207.42,28.57 208.38,29.53 208.38,35.56 206.47,37.46 198.85,37.46 195.99,34.61 195.99,30.8 199.28,27.51 VD9.A 199.28,23.64 | VT6.E 216.99,39.88 | 216.99,39.88 VD6.A | VT9.E 199.28,23.64 | 199.28,23.64 201.39,21.53 201.39,18.73 198.85,16.19 195.99,16.19 | 195.99,16.19 193.45,18.73 193.45,23.18 188.06,35.56 182.98,40.96 181.5,42.43 | VD16.A VT16.E 164.26,80.76 162.56,79.06 158.59,79.06 153.51,84.14 147.64,84.14 146.53,82.71 140.17,82.71 | VD49.A VT49.E | 176.53,33.02 176.55,33.35 | 176.55,33.35 176.53,34.29 176.53,36.11 arc45 SJ1.1 SJ1.2 174.06,39.01 arc45 173.2,39.37 171.93,39.37 arc90 170.02,37.62 169.86,32.07 169.86,31.59 arc90 172.4,29.05
  Bottom 0.61: C5.2 176.55,33.35 | 163.51,43.32 VT19.E VD19.A 163.78,47.78 VD18.A | 163.51,43.32 163.51,40.32 arc-90 161.61,38.42 161.29,38.42 arc-90 159.07,40.64 159.07,42.23 arc90 156.84,45.09 | VT13.E 203.37,47.77 | 203.37,47.77 205.42,45.72 205.42,43.02 203.04,40.64 196.85,40.64 195.1,42.39 195.1,46.35 | VD13.A 205.31,49.71 203.37,47.77 | VD11.A 195.19,51.96 | 195.19,51.96 VT11.E | 181.5,42.43 178.05,45.88 166.07,45.88 163.51,43.32 | IC2.13 206.08,64 207.96,65.41 | DD1A.13 177.32,20.16 173.07,20.16 | BT1.2 167.71,16.42 171.61,20.16 173.07,20.16 | DD1A.13 DD1A.12 DD1A.11 DD1A.10 DD1A.9 | DD1A.8 DD1A.7 DD1A.6 DD1A.5 176.05,14.45 177.32,15.72 | 177.32,15.72 DD1A.13 | 173.07,20.16 C8.2 DD1B.4 173.07,25.05 arc-90 171.45,26.67 171.45,27.51 J3.1 | 177.32,15.72 178.59,14.45 182.25,14.45 183.04,15.08 C7.2 | VD26.A VT26.E 105.9,77.75 106.36,78.22 106.36,80.33 102.23,84.45 99.7,84.45 98.91,83.67 VT29.E VD29.A 90.38,83.3 86.36,84.77 84.63,84.77 VT28.E VD28.A 80.12,85.52 78.74,84.14 70.8,84.14 69.7,83.04 VT27.E VD27.A 65.84,83.93 65.09,83.19 65.09,79.38 66.04,78.42 67.94,78.42 69.22,77.15 69.22,73.98 67.63,72.39 67.63,65.09 68.73,63.99 68.9,63.99 | VD39.A VT39.E 75.56,44.94 75.56,49.85 76.84,51.12 76.84,56.2 75.25,57.78 73.34,57.78 | VT45.E VD45.A 46.09,49.06 46.09,49.21 | VD17.A VT17.E 163.78,69.41 VD18.A | VT18.E VD18.A | C6.2 149.39,28.26 J2.1 144.57,29.06 ISP.6 143.82,27.61 v142.88,26.67 | VT50.E VD50.A 15.51,50.01 | 9.21,50.01 9.05,50.01 9.05,36.51 10.38,35.18 | 9.21,50.01 15.51,50.01 | 15.51,50.01 17.3,50.01 18.57,51.28 18.57,56.2 16.67,58.1 12.38,58.1 | VD49.A 8.53,29.96 7.78,29.21 7.78,25.4 10.16,23.02 10.16,19.68 16.51,13.34 20,13.34 22.23,15.56 22.23,17.78 20.03,19.97 VD48.A
  Bottom 0.61: 10.38,35.18 VD49.A | VT52.E VD52.A 27.15,52.86 28.26,51.91 28.26,46.2 17.15,35.08 10.48,35.08 10.38,35.18 | VT47.E VD47.A 30.15,21.29 31.1,20.33 37.78,20.33 | VT40.E VD40.A 18.64,77.56 18.73,77.47 | VD41.A VT41.E 30.06,78.63 28.1,76.68 25.08,76.68 23.5,78.26 | IC6.13 32.96,63.44 32.07,62.55 30.48,62.55 29.37,61.44 28.42,61.44 27.88,60.9 IC6.8 26.19,59.22 C10.2 | 46.2,51.97 VT44.E | 23.5,78.26 23.5,80.8 26.19,83.5 29.37,83.5 30.8,84.93 34.75,84.93 VD42.A 37.46,85.68 VT42.E | 23.5,78.26 22.7,77.47 18.73,77.47 | 18.73,77.47 13.65,77.47 9.21,73.03 9.21,69.22 6.98,66.99 6.98,52.23 9.21,50.01 | VT44.E VD44.A 50.05,51.64 51.12,52.7 51.12,55.88 46.36,60.32 46.36,72.07 45.67,72.76 VT43.E VD43.A | 89.49,61.59 IC5.13 | 65.72,33.02 66.68,32.07 66.68,28.11 VT36.E VD36.A 68.78,21.38 69.85,20.32 74.3,20.32 76.67,17.95 VT35.E VD35.A 79.26,13.77 80.33,12.7 84.14,12.7 86.68,15.24 98.43,15.24 99.38,16.19 VD34.A | 65.72,33.02 65.72,48.05 VD37.A 66.25,53.23 67.31,54.29 VT37.E 69.1,54.61 69.1,57.78 | 55.88,33.02 65.72,33.02 | 69.1,57.78 VD38.A 68.9,62.12 68.9,63.99 | 70.8,57.78 69.1,57.78 | VT38.E 68.9,63.99 | IC7.13 21.92,67.64 | 12.38,58.1 11.57,58.1 VD51.A | VT51.E 12.54,57.95 12.38,58.1 | IC3.8 141.93,59.69 C12.2 140.02,60.96 v139.06,60.64 | VT12.E VD12.A 185.1,60.85 185.1,53.6 187.91,50.8 | C2.2 210.82,63.82 208.63,66.01 | 192.09,46.35 187.91,46.35 | 187.91,46.35 187.91,50.8 | 195.19,51.96 194.03,50.8 187.91,50.8 | 140.17,82.71 VD14.A 139.7,80.94 139.7,76.52 v140.34,75.88 140.65,75.56 145.97,75.56 147.36,76.95 VT15.E VD15.A | 140.17,82.71 136.72,86.17 VT14.E | 181.5,42.43 183.94,44.88 VD10.A 187.91,44.88
  Bottom 0.61: 187.91,44.88 187.91,46.35 | VT10.E 187.91,44.88 | 89.85,61.91 89.53,61.59 89.49,61.59 | 89.49,61.59 C11.2 | IC5.8 84.41,53.34 v81.28,53.34 | VT34.E VD34.A | 145.59,21.59 152.4,21.59 155.1,18.89 155.1,15.56 | 195.99,16.19 193.99,14.19 193.99,9.21 187.64,2.86 167,2.86 155.1,14.76 155.1,15.56 | 46.09,49.21 VT44.E | 55.88,33.02 55.88,39.42 46.09,49.21 | VD48.A VT48.E | VT31.E VD31.A 107,60.96 | 115.59,60.02 115.57,57.81 115.57,50.8 111.12,46.35 107.11,46.35 VD32.A 106.48,44.45 104.25,42.23 | 115.59,60.02 118.76,60.02 119.06,60.32 119.06,63.18 122.35,66.47 VD25.A VT25.E 126.22,67.16 128.59,69.53 131.76,69.53 v133.03,68.26 134.26,67.04 134.26,61.91 | 115.59,60.02 108.25,60.02 107,60.96 | 107,60.96 106.83,61.13 VT30.E VD30.A | VT54.E VD54.A 120.45,31.11 123.19,31.11 125.73,28.57 125.73,21.27 131.76,15.24 137.16,15.24 138.11,14.29 144.78,14.29 146.05,15.56 155.1,15.56 | 134.26,61.91 134.26,61.64 134.94,60.96 VT24.E | 134.26,61.91 131.44,61.91 129.86,60.32 VD24.A 128.22,59.01 127.32,58.1 127.32,49.85 125.41,47.94 122.24,47.94 121.28,48.89 119.38,48.89 117.48,46.99 117.48,45.72 114.62,42.86 114.62,39.86 VT53.E VD53.A | VT23.E VD23.A VD22.A VT22.E 132.88,28.88 133.99,27.78 133.99,22.65 VD21.A 135.95,22.5 136.22,22.22 | 104.25,42.23 VD33.A VT33.E 104.63,28.4 106.05,26.99 106.05,22.54 102.12,18.62 VD34.A | VT32.E 104.25,42.23 | 136.22,22.22 136.22,23.49 138.75,23.49 141.02,21.23 VD20.A 145.3,21.59 145.59,21.59 | 136.22,22.22 VT21.E | VT20.E 145.59,21.59 | VD48.A 20.64,20.84 20.64,22.22 21.43,23.02 v23.65,23.02 | v36.35,35.56 41.12,30.8 | 55.88,33.02 53.66,30.8 41.12,30.8
  Bottom 0.61: 41.12,30.8 38.1,27.78 38.1,23.49 37.78,23.18 37.78,20.33 | VD46.A 38.08,20.33 | 38.08,20.33 VT46.E | 38.08,20.33 37.78,20.33
N$1
  Bottom 0.61: R2.1 191.55,80.63 VT1.C
N$2
  Bottom 0.406: VT1.B 187.8,81.44 190.82,78.42 192.72,78.42 195.14,80.84 R1.2
  Bottom 0.61: VT1.B VD1.C
N$3
  Bottom 0.61: R34.1 VT17.C
N$4
  Bottom 0.61: R4.1 VT2.C
N$5
  Bottom 0.406: VT2.B 203.35,80.59 205.2,79.38 207.33,79.38 210.19,82.23 213.53,82.23 R3.2
  Bottom 0.61: VT2.B VD2.C
N$6
  Bottom 0.61: R18.1 VT9.C
N$7
  Bottom 0.61: VT9.B VD9.C R17.2
N$8
  Bottom 0.61: VT10.C R20.1
N$9
  Bottom 0.406: VT10.B 188.86,38.15 190.18,36.83 192.88,36.83 194.15,38.1 194.15,40.96 193.52,41.59 R19.2
  Bottom 0.61: VD10.C VT10.B
N$10
  Bottom 0.61: VT11.C R22.1
N$11
  Bottom 0.61: VD11.C VT11.B R21.2
N$12
  Bottom 0.61: VT12.C R24.1
N$13
  Bottom 0.61: VT12.B VD12.C R23.2
N$14
  Bottom 0.61: R26.1 VT13.C
N$15
  Bottom 0.61: VT13.B VD13.C R25.2
N$16
  Bottom 0.61: R28.1 133.71,83.2 VT14.C
N$17
  Bottom 0.406: IC5.14 90.76,60.28 91.12,60.64 93.98,60.64 95.16,61.82 J6.2
N$18
  Bottom 0.61: R6.1 VT3.C
N$19
  Bottom 0.61: VT3.B VD3.C 222.75,71.52 221.79,70.57 R5.2
N$20
  Bottom 0.61: R8.1 VT4.C
N$21
  Bottom 0.61: R7.2 VD4.C VT4.B
N$22
  Bottom 0.61: VT5.C 223.3,49.94 R10.1
N$23
  Bottom 0.61: VT5.B VD5.C 216.76,44.32 215.68,45.4 R9.2
N$24
  Bottom 0.61: VT6.C R12.1
N$25
  Bottom 0.61: VT6.B VD6.C 213.81,36.48 212.82,37.46 212.82,42.23 213.41,42.81 R11.2
N$26
  Bottom 0.61: VT7.C R14.1
N$27
  Bottom 0.61: VT7.B VD7.C 216.32,33.16 R13.2
N$28
  Bottom 0.61: VT8.C R16.1
N$29
  Bottom 0.61: VT8.B VD8.C R15.2
N$30
  Bottom 0.61: VD14.C R27.2 135.3,79.42 134.78,78.9 130.97,78.9 129.54,80.33 129.54,83.34 132.36,86.17 VT14.B
N$31
  Bottom 0.61: DD1B.2 arc-90 171.87,32.28 Z1.P$1
N$32
  Bottom 0.406: R33.2 157.32,72.1 arc-45 157.41,72.32 158.43,73.34 162.75,73.34 arc-45 162.97,73.25 163.25,72.97 arc-45 163.34,72.75 VT17.B
  Bottom 0.61: VT17.B VD17.C
N$33
  Bottom 0.61: DD1B.1 174.42,34.71 arc90 Z1.P$2
N$34
  Bottom 0.61: R30.1 VT15.C
N$35
  Bottom 0.61: VT15.B VD15.C R29.2
N$36
  Bottom 0.61: R32.1 VT16.C
N$37
  Bottom 0.61: VT16.B VD16.C R31.2
N$38
  Bottom 0.61: R36.1 VT18.C
N$39
  Bottom 0.406: R35.2 157.93,50.3 158.75,51.12 158.75,56.66 VT18.B
  Bottom 0.61: VT18.B VD18.C
N$40
  Bottom 0.61: R38.1 VT19.C
N$41
  Bottom 0.406: R37.2 150.33,48.26 150.97,48.89 153.99,48.89 154.31,48.58 158.43,48.58 159.59,47.42 VD19.C
  Bottom 0.61: VD19.C VT19.B
N$42
  Bottom 0.61: VT20.C 151.86,19.05 R40.1
N$43
  Bottom 0.406: R39.2 139.54,51.75 136.21,51.75 126.52,42.07 126.52,34.45 127.32,33.66 127.32,22.54 132.87,16.99 137.95,16.99 138.75,16.19 140.65,16.19 142.29,17.83 VD20.C
  Bottom 0.61: VT20.B VD20.C
N$44
  Bottom 0.61: VT21.C R42.1
N$45
  Bottom 0.406: R41.2 136.75,49.85 136.21,49.85 127.79,41.43 127.79,35.56 128.59,34.77 128.59,23.49 132.99,19.1 VD21.C
  Bottom 0.61: VT21.B VD21.C
N$46
  Bottom 0.61: R44.1 VT22.C
N$47
  Bottom 0.406: VD22.C 130.38,35.2 129.06,36.51 129.06,40.8 135.25,46.99 136.37,46.99 137.64,48.26 139.06,48.26 R43.2
  Bottom 0.61: VT22.B VD22.C
N$48
  Bottom 0.61: VT23.C R46.1
N$49
  Bottom 0.406: R45.2 136.53,39.53 136.53,37.15 135.25,35.88 134.61,35.88 VT23.B
  Bottom 0.61: VT23.B VD23.C
N$50
  Bottom 0.61: VT24.C R48.1
N$51  (1 unrouted)
  Bottom 0.406: 134.94,54.13 134.94,52.7 133.03,50.8 130.81,50.8 129.22,52.39 129.22,54.97 VD24.C 132.66,58.41 VT24.B | 137.8,56.99 R47.2
N$52
  Bottom 0.61: VT25.C R50.1
N$53
  Bottom 0.61: VD25.C VT25.B 126.53,61.13 R49.2
N$54
  Bottom 0.61: VT26.C 110.17,74.93 R52.1
N$55
  Bottom 0.406: R51.2 VD26.C
  Bottom 0.61: VD26.C VT26.B
N$56
  Bottom 0.61: VT27.C R54.1
N$57
  Bottom 0.61: VD27.C VT27.B R53.2
N$58
  Bottom 0.61: VT28.C R56.1
N$59
  Bottom 0.406: R55.2 89.54,79.69 87.31,79.69 85.26,80.79 VT28.B
  Bottom 0.61: VD28.C VT28.B
N$60
  Bottom 0.61: VT29.C R58.1
N$61
  Bottom 0.406: R57.2 VD29.C
  Bottom 0.61: VT29.B VD29.C
N$62
  Bottom 0.61: R60.1 VT30.C
N$63
  Bottom 0.406: VD30.C 106.83,68.06 | 106.83,68.06 VT30.B | 106.83,68.06 105.99,68.9 R59.2
N$64
  Bottom 0.406: VT31.C 100.18,56.69 99.06,55.56 99.06,52.39 100.97,50.48 102.87,50.48 103.46,51.07 R62.1
N$65
  Bottom 0.61: VT31.B VD31.C R61.2
N$66
  Bottom 0.61: R64.1 VT32.C
N$67
  Bottom 0.61: R63.2 VD32.C VT32.B
N$68
  Bottom 0.61: VT33.C R66.1
N$69
  Bottom 0.61: R65.2 VD33.C VT33.B
N$70
  Bottom 0.61: R68.1 VT34.C
N$71
  Bottom 0.61: VT34.B VD34.C R67.2
N$72
  Bottom 0.406: DD2.8 153.24,36.5 Q1.1
  Bottom 0.61: Q1.1 C4.2
N$73
  Bottom 0.61: VT53.C R112.1
N$74
  Bottom 0.61: R70.1 VT35.C
N$75
  Bottom 0.61: VD35.C VT35.B R69.2
N$76
  Bottom 0.406: C4.1 C3.1
  Bottom 0.61: J2.2 148.59,33.5 C3.1
N$77
  Bottom 0.61: N26.A R78.1
N$78
  Bottom 0.61: VT36.C R72.1
N$79
  Bottom 0.61: VT36.B VD36.C R71.2
N$80
  Bottom 0.61: R74.1 VT37.C
N$81
  Bottom 0.61: R73.2 VD37.C 69.7,49.27 VT37.B
N$82
  Bottom 0.61: VT38.C R76.1
N$83
  Bottom 0.406: R75.2 72.5,60.12 VD38.C
  Bottom 0.61: VD38.C VT38.B
N$84
  Bottom 0.61: VD53.C VT53.B R111.2
N$85
  Bottom 0.61: VT39.B VD39.C R77.2
N$86
  Bottom 0.61: R80.1 VT40.C
N$87
  Bottom 0.61: VT40.B VD40.C R79.2
N$88
  Bottom 0.61: R82.1 VT41.C
N$89
  Bottom 0.61: VT41.B VD41.C 33.87,81.71 R81.2
N$90
  Bottom 0.61: R84.1 41.2,82.25 VT42.C
N$91
  Bottom 0.406: 37.78,82.24 37.79,82.26 | R83.2 38.26,72.23 40.01,73.98 40.01,79.38 39,80.38 VT42.B
  Bottom 0.61: VD42.C 37.79,82.26 VT42.B
N$92
  Bottom 0.61: VT43.C R86.1
N$93
  Bottom 0.406: R85.2 42.64,64.67 40.32,66.99 40.32,71.44 41.65,72.76 VT43.B
  Bottom 0.61: VT43.B VD43.C
N$94
  Bottom 0.61: R88.1 VT44.C
N$95
  Bottom 0.406: R87.2 45.5,55.78 46.09,55.19 VT44.B
  Bottom 0.61: VT44.B VD44.C
N$96
  Bottom 0.61: R90.1 VT45.C
N$97
  Bottom 0.406: R89.2 36.2,46.67 38.05,44.82 VT45.B
  Bottom 0.61: VT45.B VD45.C
N$98
  Bottom 0.61: VT46.C R92.1
N$99
  Bottom 0.61: VD46.C VT46.B 43.83,20.33 44.77,21.27 44.77,26.36 R91.2
N$100
  Bottom 0.61: VT47.C R94.1
N$101
  Bottom 0.61: VT47.B VD47.C 34.92,22.86 35.62,23.56 R93.2
N$102
  Bottom 0.61: R96.1 17.07,16.87 VT48.C
N$103
  Bottom 0.406: VD48.C 17.62,22.77 R95.2
  Bottom 0.61: VT48.B VD48.C
N$104
  Bottom 0.61: R98.1 VT49.C
N$105
  Bottom 0.406: R97.2 17.94,28.42 18.42,27.94 18.42,26.19 15.72,23.49 13.45,23.49 VD49.C
  Bottom 0.61: VT49.B VD49.C
N$106
  Bottom 0.61: VT50.C R100.1
N$107
  Bottom 0.406: VT50.B 11.51,44.38 10.8,43.66 10.8,39.21 12.7,37.31 16.19,37.31 18.64,39.75 R99.2
  Bottom 0.61: VD50.C VT50.B
N$108
  Bottom 0.61: VT51.C 14.46,53.92 R102.1
N$109
  Bottom 0.61: VT51.B 9.6,56.12 8.94,56.79 8.94,61.87 | 8.94,61.87 VD51.C | 8.94,61.87 8.94,63.96 R101.2
N$110
  Bottom 0.61: VT52.C R104.1
N$111
  Bottom 0.61: VT52.B VD52.C R103.2
N$112
  Bottom 0.406: Q1.2 151.76,31.43 DD2.7
  Bottom 0.61: C3.2 Q1.2
N$113
  Bottom 0.61: R114.1 VT54.C
N$114
  Bottom 0.61: DD1A.1 181.13,5.71 R110.1
N$115
  Bottom 0.406: DD1A.4 177.32,11.43 178.75,12.86 R113.1
N$116
  Bottom 0.61: VT54.B VD54.C R105.2
N$117  (1 unrouted)
N$118  (2 unrouted)
RA1
  Bottom 0.406: IC1.15 209.42,78.1 204.19,78.1 200.82,80.84 R1.1
RA2
  Bottom 0.406: R3.1 216.68,79.33 216.95,78.58 216.95,74.33 IC1.1
RA3
  Bottom 0.406: IC1.2 217.12,70.57 R5.1
RA4
  Bottom 0.406: R7.1 219.09,56.91 218.22,58.1 218.22,67.36 IC1.3
RA5
  Bottom 0.406: IC1.4 216.95,66.83 216.95,53.09 R9.1
RA6
  Bottom 0.406: IC1.5 215.68,66.3 215.68,55.56 213.41,53.29 R11.1
RA7
  Bottom 0.406: IC1.6 214.41,66.1 214.41,56.2 211.87,53.66 211.87,49.53 211.23,48.89 211.23,35.26 R13.1
RA8
  Bottom 0.406: R15.1 211.06,33.52 209.96,34.61 209.96,53.66 213.14,56.83 213.14,65.57 IC1.7
RA9
  Bottom 0.406: R17.1 194.09,34.92 198.06,38.89 203.3,38.89 208.69,44.13 208.69,53.02 204.56,55.88 203.3,60.32 IC2.15
RA10
  Bottom 0.406: IC2.1 199.49,58.28 199.49,50.16 197.27,47.95 R19.1
RA11
  Bottom 0.61: IC2.2 198,59.16 R21.1
RA12
  Bottom 0.406: IC2.3 197.58,60.32 194.72,60.32 R23.1
RA13
  Bottom 0.406: R25.1 202.34,58.1 201.39,61.59 200.75,62.23 IC2.4
RB1
  Bottom 0.406: IC2.5 195.99,62.55 195.04,62.55 193.45,64.45 192.18,70.48 184.88,77.15 184.88,78.42 181.07,82.23 171.13,82.23 167.96,79.06 166.85,79.06 163.67,75.88 151.61,75.88 149.22,73.5 138.59,73.5 136.71,75.38 R27.1
RB2
  Bottom 0.406: IC2.6 195.99,63.82 195.68,63.82 194.41,65.41 193.13,71.12 186.47,77.47 186.47,78.74 181.7,83.5 170.81,83.5 167.64,80.33 166.05,80.33 163.04,77.31 157.64,77.31 154.67,80.28 R29.1
RB3
  Bottom 0.406: IC2.7 196.31,65.09 195.36,66.36 193.77,71.75 187.74,77.79 188.06,79.06 182.34,84.77 170.88,84.77 R31.1
RB4
  Bottom 0.406: IC3.15 150.81,52.07 151.45,52.7 152.88,52.7 154.62,51.75 156.53,51.75 157.48,52.7 157.48,61.28 158.75,62.55 158.75,65.88 R33.1
RB5  (via drill 0.8 pad 2.3)
  Top 0.406: v153.03,46.99 144.46,47.31 v141.13,49.69
  Bottom 0.406: IC3.1 141.96,50.36 v141.13,49.69
  Bottom 0.61: v153.03,46.99 R35.1
RB6
  Bottom 0.406: IC3.2 144.15,52.39 144.62,51.91 144.62,48.74 143.51,47.62 142.08,47.62 138.75,44.29 138.75,43.34 140.02,42.07 143.03,42.07 148.11,47.15 R37.1
RB7
  Bottom 0.406: IC3.3 140.81,53.34 R39.1
RB8
  Bottom 0.406: IC3.4 141.29,54.61 140.34,55.56 138.75,55.56 137.16,53.97 R41.1
RB9
  Bottom 0.406: IC3.5 144.15,55.88 144.78,55.24 144.78,53.5 145.73,52.55 145.73,48.1 142.77,45.14 R43.1
RB10
  Bottom 0.406: IC3.6 144.78,57.15 145.73,56.2 145.73,54.13 146.69,53.18 146.69,49.85 147,49.53 147,47.78 142.4,43.18 141.13,43.18 R45.1
RB11
  Bottom 0.406: IC3.7 140.17,58.42 R47.1
RB12  (via drill 0.8 pad 2.3)  (1 unrouted)
  Top 0.254: v121.92,60.64 111.44,63.18 80.33,67.31 79.06,70.17 v77.79,77.15
  Bottom 0.406: IC4.15 78.26,77.63 v77.79,77.15
  Bottom 0.61: R49.1 v121.92,60.64
RB13  (via drill 0.8 pad 2.3)
  Top 0.406: v97.47,71.75 v92.08,77.15
  Bottom 0.406: IC4.1 90.71,78.01 v92.08,77.15 | R51.1 99.06,73.34 v97.47,71.75
RC1
  Bottom 0.406: R53.1 74.29,78.42 76.52,80.33 84.14,80.33 84.44,80.11 87.46,77.09 IC4.2
RC2
  Bottom 0.406: IC4.3 92.93,74.83 94.62,76.52 94.62,77.79 93.66,79.06 R55.1
RC3
  Bottom 0.406: IC4.4 93.88,73.25 95.89,74.3 R57.1
RC4
  Bottom 0.406: R59.1 96.84,69.85 95.15,70.7 89.85,73.03 IC4.5
RC5
  Bottom 0.406: R61.1 99.38,65.41 95.03,69.44 90.17,71.75 IC4.6
RC6
  Bottom 0.406: R63.1 100.33,48.26 97.79,50.8 97.79,60.01 98.43,60.64 98.43,64.13 94.08,68.48 89.85,70.48 IC4.7
RC7
  Bottom 0.406: R65.1 100.97,36.38 arc45 100.87,36.6 96.84,40.64 96.84,48.58 95.57,49.85 95.57,53.97 94.62,54.93 93.03,54.93 92.03,55.93 IC5.15
RC8
  Bottom 0.406: IC5.1 93.34,52.64 93.34,50.16 95.25,48.26 95.25,39.69 98.81,36.13 98.81,26.42 arc45 98.9,26.19 R67.1
RC9
  Bottom 0.406: IC5.2 92.03,44.4 84.14,33.66 76.2,33.66 76.2,28.89 R69.1
RC10
  Bottom 0.406: IC5.3 90.76,45.04 83.5,34.92 75.56,34.92 74.61,33.97 74.61,27.3 74.93,26.99 R71.1
RC11
  Bottom 0.406: IC5.4 89.49,45.67 82.87,36.2 74.61,36.2 72.07,38.73 72.07,42.55 R73.1
RC12
  Bottom 0.406: IC5.5 88.22,46.35 84.09,39.96 82.23,37.46 75.25,37.46 73.66,39.05 73.66,50.16 75.56,52.07 75.56,54.93 74.21,56.29 R75.1
RC13
  Bottom 0.406: IC5.6 86.95,49.8 R77.1
RCLOCK_MISO_D12  (via drill 0.8 pad 2.3)
  Top 0.254: v198.85,71.44 181.93,71.44 177.17,66.67 v155.26,62.55 | v28.89,69.22 30.8,63.82 62.87,63.82 67.31,63.18 v77.47,63.18 78.11,66.99 80.01,69.22 144.46,67.63 146.69,66.67 151.13,66.67 v155.26,62.55 | v141.61,38.1 155.57,45.09 155.57,49.53 153.99,51.43 150.81,52.7 150.81,56.83 156.21,59.05 v155.26,62.55
  Bottom 0.305: 86.95,57.26 85.73,56.12 81.6,56.12 | IC1.11 208.6,71.91 208.6,70.48 205.11,66.67 204.72,66.04
  Bottom 0.406: DD2.16 160.34,36.04 159.38,36.99 158.75,36.99 157,38.73 157,40.48 154.15,44.29 148.75,44.29 143.99,39.53 143.03,39.53 v141.61,38.1 141.28,37.77 ISP.1 | 204.72,66.04 IC2.11 202.09,65.34 201.07,65.72 200.12,68.74 199.17,70.17 v198.85,71.44 | IC7.11 17.93,70.18 17.46,70.64 17.46,73.66 18.1,74.3 21.43,74.3 22.86,72.87 25.24,72.87 v28.89,69.22 30.42,67.68 IC6.11 | IC5.11 86.95,57.26 | 81.6,56.12 77.47,60.32 v77.47,63.18 77.47,68.26 79.59,71.97 79.87,72.25 IC4.11 | IC3.11 150.5,57.15 151.45,57.78 153.99,57.78 155.26,59.05 v155.26,62.55 155.57,62.86
RD1  (via drill 0.8 pad 2.3)
  Top 0.254: v81.28,49.85 77.79,45.72 74.3,46.04 27.31,56.52 21.43,62.39 v21.43,80.01
  Bottom 0.406: IC5.7 85.68,51.39 84.14,49.85 v81.28,49.85
  Bottom 0.61: R79.1 22.6,81.98 21.43,80.8 v21.43,80.01
RD2
  Bottom 0.406: IC6.15 35.5,67.09 36.2,69.69 36.2,72.07 38.73,74.61 38.73,76.83 38.16,77.41 R81.1
RD3
  Bottom 0.406: IC6.1 37.95,59.22 40.32,61.59 40.32,64.77 38.26,66.83 R83.1
RD4
  Bottom 0.406: 35.5,58.48 IC6.2 35.5,58.16 35.88,57.78 36.2,57.78 36.83,57.15 39.05,57.15 42.64,60.74 R85.1
RD5
  Bottom 0.406: IC6.3 34.23,57.84 34.61,57.47 34.92,57.47 36.61,55.78 R87.1
RD6
  Bottom 0.406: IC6.4 32.96,57.84 36.2,54.61 R89.1
RD7
  Bottom 0.406: IC6.5 31.69,57.36 34.13,54.93 34.13,41.43 39.33,36.24 R91.1
RD8
  Bottom 0.406: IC6.6 30.42,58 30.96,57.47 30.96,55.72 32.54,54.13 32.54,42.07 31.97,41.5 31.97,35.97 34.13,33.81 34.13,31.84 35.62,30.35 R93.1
RD9
  Bottom 0.406: IC6.7 29.15,57.21 29.53,56.83 29.53,54.93 31.27,53.18 31.27,44.93 21.43,35.08 R95.1
RD10
  Bottom 0.406: R97.1 17.94,33.66 29.84,45.56 29.84,52.55 28.1,54.29 28.1,55.72 27.46,56.36 25.56,56.36 24.61,57.31 24.61,59.85 23.81,60.64 20.48,60.64 18.89,62.23 17.84,62.23 17.37,62.71 17.37,64.52 17.95,65.1 IC7.15
RD11
  Bottom 0.406: R99.1 18.64,49.12 20,50.48 20,57.15 17.78,59.37 14.45,59.37 13.47,60.35 IC7.1
RD12
  Bottom 0.61: IC7.2 11.34,65.1 R101.1
RD13
  Bottom 0.406: IC7.3 15.39,66.37 15.72,66.04 15.72,61.59 16.51,60.8 18.42,60.8 20.64,58.58 R103.1
RDATA_MOSI_D11  (via drill 0.8 pad 2.3)
  Top 0.406: v195.42,77.95 192.56,76.36 163.83,38.1 v149.54,39.21
  Bottom 0.406: ISP.4 145.72,34.28 145.73,38.42 145.73,38.73 146.21,39.21 v149.54,39.21 149.54,41.91 150.97,43.34 153.51,43.34 156.05,40 156.05,38.26 158.12,36.2 158.75,36.2 159.53,35.41 DD2.15 | IC1.14 208.92,76.99 206.22,76.83 203.2,76.83 201.3,78.42 198.44,78.42 v195.42,77.95
RE1
  Bottom 0.61: R111.1 RE1.1
RE2
  Bottom 0.61: RE2.1 R105.1
RESET
  Bottom 0.356: 155.1,26.99 153.19,25.08
  Bottom 0.406: DD2.29 157.13,26.38 156.53,26.99 155.1,26.99 | 153.19,25.08 150.5,25.08 | 150.5,25.08 148.75,25.08 147.16,26.67 145.73,26.67 143.51,24.45 141.61,24.45 140.34,25.72 140.34,28.87 ISP.5 | R109.1 150.5,25.08
RLATCH_D10  (via drill 0.8 pad 2.3)
  Top 0.254: v196.63,73.34 154.75,56.2 v152.4,55.88 142.56,72.39 101.28,72.07 90.17,80.33 73.03,78.1 v75.56,65.41 75.25,65.09 69.22,65.09 68.26,72.39 35.08,72.39 v31.53,69.59
  Top 0.406: v152.4,55.88 152.4,52.86 153.19,52.39 155.1,51.43 157,49.53 157,45.4 v152.72,41.12
  Bottom 0.305: 88.22,56.94 86.68,55.4 80.01,55.4 | IC1.12 209.55,72.75 209.55,70.48 207.65,68.58 207.33,66.99 206.06,65.41 IC2.12
  Bottom 0.406: IC2.12 201.73,64.11 200.28,64.61 199.01,68.42 196.63,70.8 v196.63,73.34 | DD2.14 158.74,34.78 158.12,35.4 157.48,35.4 154.94,37.94 154.94,39.69 153.83,40.8 v152.72,41.12 | IC3.12 v152.4,55.88 | IC7.12 17.3,68.91 16.51,69.69 16.51,74.3 17.62,75.41 22.07,75.41 23.34,74.14 26.99,74.14 v31.53,69.59 31.69,69.43 IC6.12 | IC5.12 88.22,56.94 | 80.01,55.4 75.56,60.01 v75.56,65.41 76.52,68.58 78.64,72.29 79.38,73.34 80.65,73.34 81.14,73.83 IC4.12
SCK
  Bottom 0.406: DD2.17 161.83,35.82 159.7,37.94 159.23,37.94 157.8,39.37 157.8,41.34 154.8,45.29 147.84,45.29 143.19,40.64 140.65,40.64 139.06,39.05 139.06,33.34 140.05,32.35 ISP.3
SCL
  Bottom 0.33: 166.55,26.83 166.55,30.64
  Bottom 0.406: DD2.28 157.94,23.67 159.07,22.54 164.47,22.54 166.05,24.13 166.05,26.33 166.55,26.83 | J4.2 183.76,28.5 184.78,29.53 184.78,34.92 176.53,43.18 170.81,43.18 arc90 166.05,38.73 166.05,32.07 166.55,31.57 166.55,30.64
  Bottom 0.61: R108.1 DD1B.6 J4.2
SCL_J
  Bottom 0.406: DD1A.16 181.13,19.84 186.76,24.83 J4.1
SDA
  Bottom 0.33: 165.59,27.46 165.59,30.8
  Bottom 0.406: DD2.27 158.74,23.83 159.38,23.81 163.51,23.81 164.78,25.08 164.78,26.65 165.59,27.46 | DD1B.5 183.93,24.39 185.26,25.72 185.26,28.26 186.06,29.05 186.06,35.56 177.17,44.45 169.86,44.45 arc90 164.78,38.73 164.78,31.61 165.59,30.8
  Bottom 0.61: R107.1 DD1B.5 179.86,23.06 DD1A.15
SEQ
  Bottom 0.33: 167.46,26.16 167.46,30.55
  Bottom 0.406: DD1B.7 182.8,29.45 183.51,30.16 183.51,34.29 182.11,35.69 R106.1 180.86,36.95 175.9,41.91 171.13,41.91 arc90 167.32,38.1 167.32,32.54 167.46,32.4 167.46,30.55 | 162.24,20.95 164.78,20.95 167.32,23.49 167.32,26.02 167.46,26.16 | 162.24,20.95 157.16,20.95 154.74,23.38 DD2.32 | J5.1 162.24,20.95
SEQ_J
  Bottom 0.406: DD1A.3 178.59,7.46 177.8,6.67 169.86,6.67 162.24,14.29 J5.2
SER2  (via drill 0.8 pad 2.3)
  Top 0.406: v199.8,74.3 206.69,71.6 v208.38,62.71
  Bottom 0.406: IC2.14 207.17,62.86 v208.38,62.71 | IC1.9 204.52,72.39 201.71,72.39 v199.8,74.3
SER3  (via drill 0.8 pad 2.3)
  Top 0.406: v204.15,69.85 166.53,51.12 v155.42,53.5
  Bottom 0.406: IC2.9 v204.15,69.85 | v155.42,53.5 154.46,53.5 153.35,53.97 151.13,53.97 150.5,53.34 IC3.14
SER4  (via drill 0.8 pad 2.3)
  Top 0.254: v150.81,71.44 147,70.17 144.78,71.12 81.92,71.12 80.65,72.39 80.65,73.66 v79.85,75.41
  Bottom 0.406: IC3.9 149.54,59.69 153.03,64.77 153.03,69.22 v150.81,71.44 | IC4.14 81.13,76.36 v79.85,75.41
SER5
  Bottom 0.406: J6.1 91.85,66.67 87.63,66.67 86.36,66.36 82.55,66.67 81.98,67.25 IC4.9
SER6  (via drill 0.8 pad 2.3)
  Top 0.254: v80.96,65.09 75.56,71.12 70.17,70.8 42.55,70.17 36.51,69.85 v35.24,74.61
  Bottom 0.406: IC5.9 84.41,60.37 v80.96,65.09 | IC6.14 34.23,66.94 34.92,69.53 34.92,71.44 v35.24,74.61
SER7
  Bottom 0.406: IC7.14 21.26,66.37 21.91,65.72 24.45,65.72 24.77,66.05 27.88,66.05 IC6.9
VBAT
  Bottom 0.61: DD1B.3 174.94,26.99 175.87,26.06 C8.1 177.48,22.38 178.59,21.27 DD1A.14 178.59,16.83 179.55,15.88 181.61,15.88 183.04,17.3 186.37,17.3 187.48,16.19 187.48,10.09 BT1.1
(copper drawn outside any net)
  shapes: Bottom area x1

## Text on the board
bPlace: Е | Г | Д
bNames: Е | Н | В | А
209bmp: Т | Т | А | К | Б | У | Д | Е | С